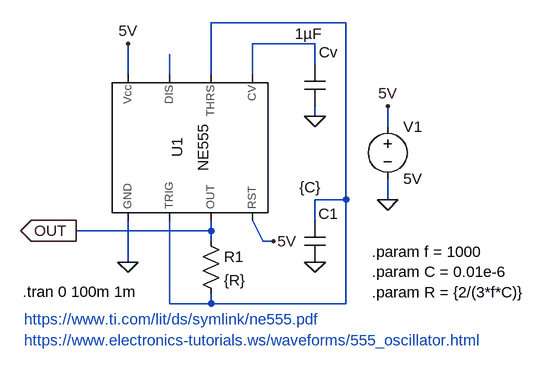
[diagram p0: schematic timer555.asc]
timer555.asc, the LTspice schematic file:
Version 4
SHEET 1 916 720
WIRE 560 96 352 96
WIRE 512 128 416 128
WIRE 512 160 512 128
WIRE 224 176 224 128
WIRE 288 176 288 144
WIRE 352 176 352 96
WIRE 416 176 416 128
WIRE 512 240 512 224
WIRE 624 256 624 224
WIRE 560 368 560 96
WIRE 560 368 512 368
WIRE 624 368 624 336
WIRE 512 400 512 368
WIRE 352 416 352 400
WIRE 352 416 144 416
WIRE 352 432 352 416
WIRE 432 432 416 400
WIRE 448 432 432 432
WIRE 224 464 224 400
WIRE 288 528 288 400
WIRE 352 528 352 512
WIRE 352 528 288 528
WIRE 560 528 560 368
WIRE 560 528 352 528
FLAG 224 464 0
FLAG 512 240 0
FLAG 512 464 0
FLAG 624 368 0
FLAG 624 224 5V
FLAG 224 128 5V
FLAG 448 432 5V
FLAG 144 416 OUT
IOPIN 144 416 Out
SYMBOL Misc\\NE555 320 288 R270
SYMATTR InstName U1
SYMBOL cap 496 160 R0
WINDOW 0 22 -19 Left 2
WINDOW 3 -15 -47 Left 2
SYMATTR InstName Cv
SYMATTR Value 1µF
SYMBOL res 336 416 R0
SYMATTR InstName R1
SYMATTR Value {R}
SYMBOL cap 496 400 R0
WINDOW 0 21 -10 Left 2
WINDOW 3 -8 -51 Left 2
SYMATTR InstName C1
SYMATTR Value {C}
SYMBOL voltage 624 240 R0
WINDOW 123 0 0 Left 0
WINDOW 39 0 0 Left 0
SYMATTR InstName V1
SYMATTR Value 5V
TEXT 62 510 Left 2 !.tran 0 100m 1m
TEXT 64 584 Left 2 ;https://www.electronics-tutorials.ws/waveforms/555_oscillator.html
TEXT 64 552 Left 2 ;https://www.ti.com/lit/ds/symlink/ne555.pdf
TEXT 600 448 Left 2 !.param f = 1000\n.param C = 0.01e-6\n.param R = {2/(3*f*C)}

The netlist it stands for:
* timer555.asc
XU1 0 N001 OUT 5V N002 N001 N003 5V NE555  ; pins GND TRIG OUT RST CV THRS DIS Vcc
Cv N002 0 1µF
R1 OUT N001 {R}
C1 N001 0 {C}
V1 5V 0 5V
.tran 0 100m 1m
* https://www.electronics-tutorials.ws/waveforms/555_oscillator.html
* https://www.ti.com/lit/ds/symlink/ne555.pdf
.param f = 1000
.param C = 0.01e-6
.param R = {2/(3*f*C)}
.lib NE555.sub
.backanno
.end